# EAGLE design TERMOCOUPLER-1 (EAGLE 9.6.2)
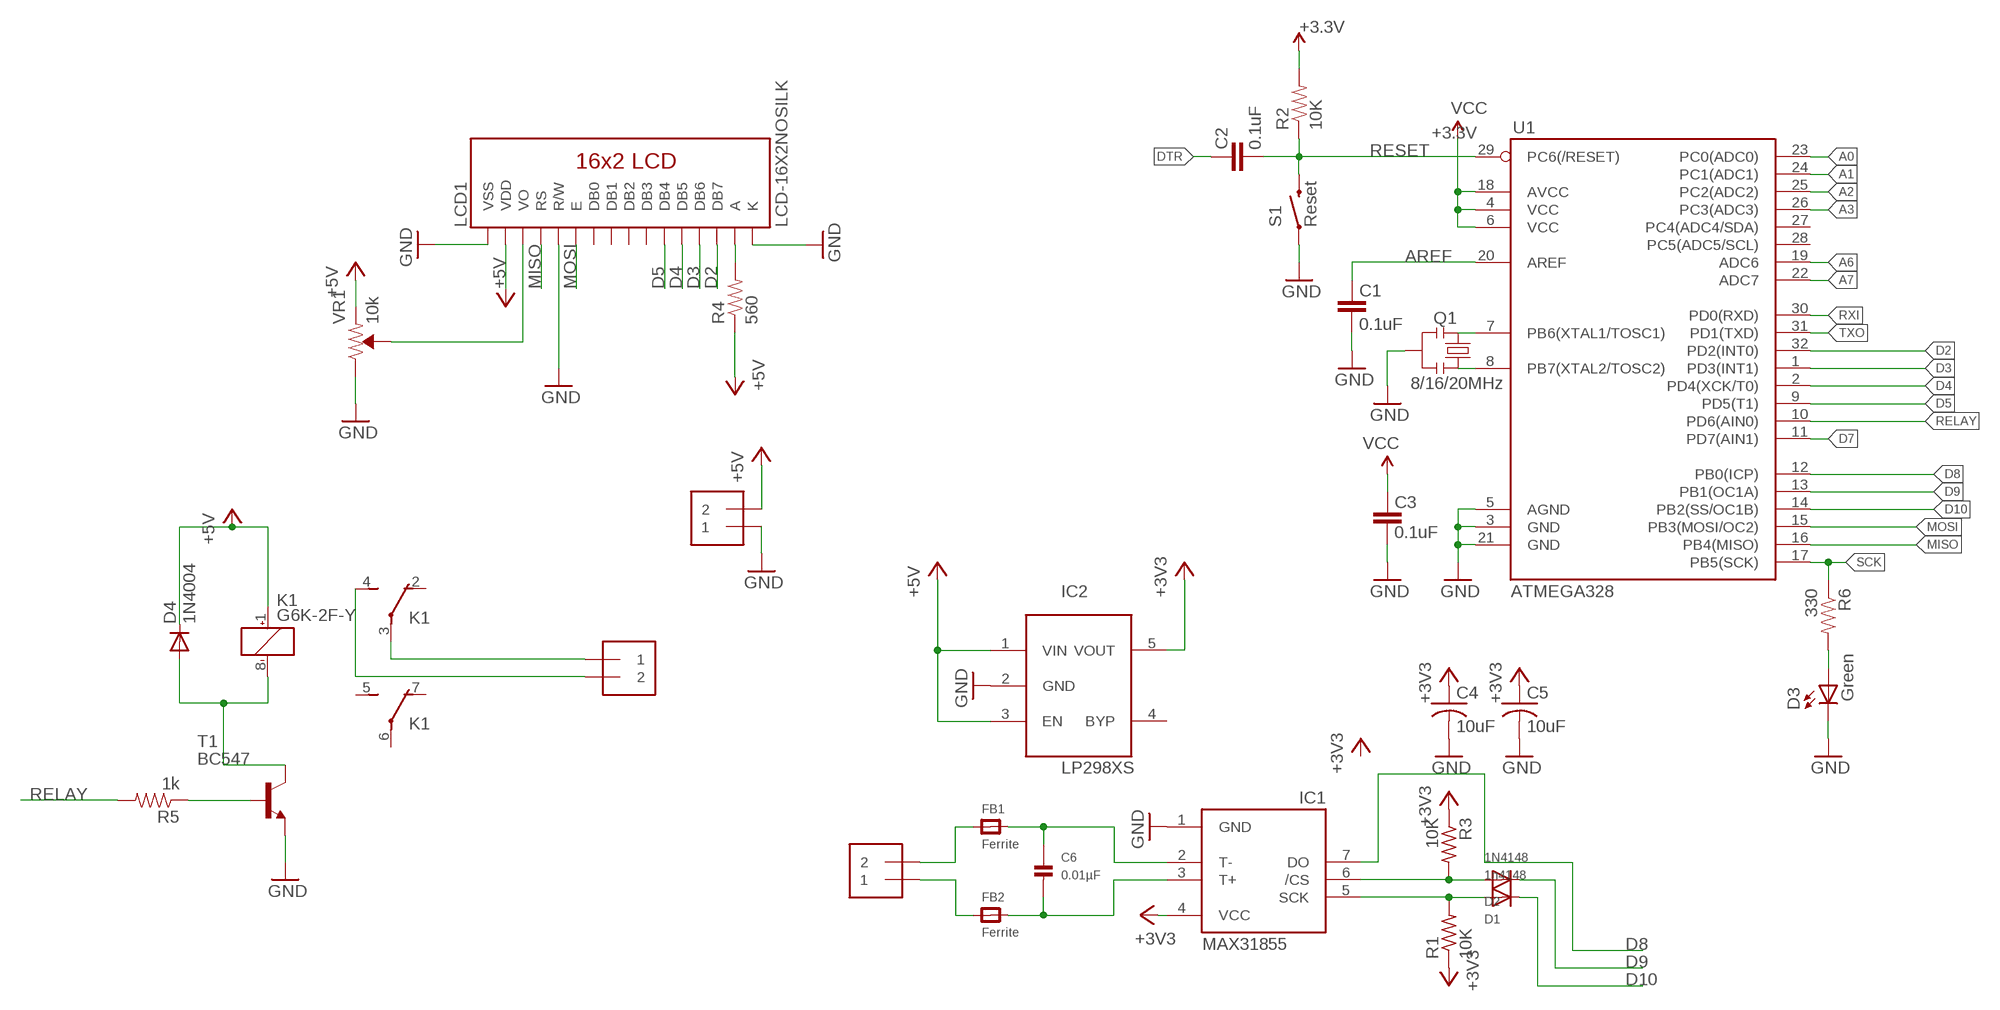
[diagram p0: schematic, sheet 1]

## Parts
C1  0.1uF  CAP0603-CAP  [0603-CAP]
C2  0.1uF  CAP0603-CAP  [0603-CAP]
C3  0.1uF  CAP0603-CAP  [0603-CAP]
C4  10uF  C-USC0805K  [C0805K]
C5  10uF  C-USC0805K  [C0805K]
C6  0.01µF  CAP_CERAMIC_0805  [_0805]
D1  1n4148  DIODESOD-323F  [SOD-323F]
D2  1N4148  DIODESOD-323F  [SOD-323F]
D3  Green  LED  [0603-LED-ALT1]
D4  1N4004  [DO41-10]
FB1  Ferrite  FERRITE_0805  [_0805]
FB2  Ferrite  FERRITE_0805  [_0805]
IC1  MAX31855  MAX6675  [SO08]
IC2  LP298XS  [SOT23-5L]
J1  1X2-3.5MM  [1X2-3.5MM]
J2  1X2-3.5MM  [1X2-3.5MM]
J3  1X2-3.5MM  [1X2-3.5MM]
K1  G6K-2F-Y  [G6K-2F-Y]
LCD1  LCD-16X2NOSILK  [LCD-16X2_NOSILK]
Q1  8/16/20MHz  RESONATOR1:1  [RESONATOR-SMD-1:1]
R1  10K  R-US_R0805  [R0805]
R2  10K  RESISTOR0603-RES  [0603-RES]
R3  10K  R-US_R0805  [R0805]
R4  560  RESISTOR0603-RES  [0603-RES]
R5  1k  RESISTOR0603-RES  [0603-RES]
R6  330  RESISTOR0603-RES  [0603-RES]
S1  Reset  SWITCH-MOMENTARY-2SMD-ALT01  [TACTILE-SWITCH-SMD-ALT01]
T1  BC547  [TO92]
U1  ATMEGA328  ATMEGA168  [TQFP32-08]
VR1  10k  TRIMPOT-SMD-3MM-CLOSED-1/8W-20%  [TRIMPOT-SMD-3MM-CLOSED]

## Nets
+3.3V: C3.2 R2.2 U1.4(VCC) U1.6(VCC) U1.18(AVCC) ; supply symbol labelled VCC
+3V3: C4.1 C5.1 IC1.4(VCC) IC2.5(VOUT) R1.1 R3.1
+5V: D4.C IC2.1(VIN) IC2.3(EN) J2.2 K1.1(1:+) LCD1.2(VDD) R4.1 VR1.1(CCW)
A0: U1.23(PC0(ADC0))
A1: U1.24(PC1(ADC1))
A2: U1.25(PC2(ADC2))
A3: U1.26(PC3(ADC3))
A6: U1.19(ADC6)
A7: U1.22(ADC7)
AREF: C1.2 U1.20(AREF)
CS: D2.A IC1.6(/CS) R3.2
D2: LCD1.14(DB7) U1.32(PD2(INT0))
D3: LCD1.13(DB6) U1.1(PD3(INT1))
D4: LCD1.12(DB5) U1.2(PD4(XCK/T0))
D5: LCD1.11(DB4) U1.9(PD5(T1))
D7: U1.11(PD7(AIN1))
D8: IC1.7(DO) U1.12(PB0(ICP))
D9: D2.C U1.13(PB1(OC1A))
D10: D1.C U1.14(PB2(SS/OC1B))
DTR: C2.2
GND [vcc]: C1.1 C3.1 C4.2 C5.2 D3.C IC1.1(GND) IC2.2(GND) J2.1 LCD1.1(VSS) LCD1.5(R/W) LCD1.16(K) Q1.2 S1.1 S1.2 T1.1(E) U1.3(GND) U1.5(AGND) U1.21(GND) VR1.3(CW)
MISO: LCD1.4(RS) U1.16(PB4(MISO))
MOSI: LCD1.6(E) U1.15(PB3(MOSI/OC2))
N$1: Q1.3 U1.8(PB7(XTAL2/TOSC2))
N$2: Q1.1 U1.7(PB6(XTAL1/TOSC1))
N$3: J3.1 K1.3(2:P)
N$4: D4.A K1.8(1:-) T1.3(C)
N$5: FB1.1 J1.2
N$6: C6.1 FB1.2 IC1.2(T-)
N$7: D3.A R6.2
N$8: FB2.1 J1.1
N$9: C6.2 FB2.2 IC1.3(T+)
N$10: J3.2 K1.4(2:S)
N$11: R5.1 T1.2(B)
N$13: LCD1.15(A) R4.2
N$18: LCD1.3(VO) VR1.2(WIPER)
RELAY: R5.2 U1.10(PD6(AIN0))
RESET: C2.1 R2.1 S1.3 S1.4 U1.29(PC6(/RESET))
RXI: U1.30(PD0(RXD))
SCK: R6.1 U1.17(PB5(SCK))
SCK1: D1.A IC1.5(SCK) R1.2
TXO: U1.31(PD1(TXD))
Unconnected: IC2.4(BYP) K1.2(2:O) K1.5(3:S) K1.6(3:P) K1.7(3:O) LCD1.7(DB0) LCD1.8(DB1) LCD1.9(DB2) LCD1.10(DB3) U1.27(PC4(ADC4/SDA)) U1.28(PC5(ADC5/SCL))

## Library data of the parts
C1-C3 = SparkFun:CAP: Capacitor Standard 0603 ceramic capacitor, and 0.1" leaded capacitor.
C4 C5 = adafruit:C-US: CAPACITOR, American symbol
C6 = microbuilder:CAP_CERAMIC: Ceramic Capacitors 0402 - 0402 Surface Mount Capacitors 16pF 50V 5% [Digikey: 445-4899-2-ND] 18pF 50V 5% [Digikey: 490-1281-2-ND] 22pF 50V 5% [Digikey: 490-1283-2-ND] 68pF 50V 5% [Digikey: 490-1289-2-ND] 0.1uF 10V 10% [Digikey: 490-1318-2-ND] 1.0uF 6.3V 10% [Digikey: 490-1320-2-ND] 0603 - 0603 Surface Mount Capacitors 16 pF 50V 5% [Digikey: 445-5051-2-ND] 22 pF 50V [Digikey: PCC220ACVTR-ND] 33 pF 50V 5% [Digikey: 490-1415-1-ND] 56pF 50V 5% [Digikey: 490-1421-1-ND] 220pF 50V 5% [Digikey: 445-1285-1-ND] 680 pF 50V 2200 pF 50V 5% C0G [Digikey: 445-1297-1-ND] 5600 pF 100V 5% X7R [Digikey: 478-3711-1-ND] 0.1 µF 25V 10% [Digikey: PCC2277TR-ND] 0.22 µF 16V 10% X7R [Digikey: 445-1318-1-ND] 1.0 µF 25V 10% [Digikey: 445-5146-2-ND] 0603 - RF Specific 3pF 250V +/-0.1pF RF [Digikey: 712-1347-1-ND] 18 pF 250V 5% [Digikey: 478-3505-1-ND or 712-1322-1-ND] 56 pF 250V 5% C0G RF [Digikey: 490-4867-1-ND] 68 pF 250V RF [Digikey: 490-4868-1-ND] 0805 - 0805 Surface Mount Capacitors 220 pF 250V 2% RF Ceramic Capacitor [Digikey: 712-1398-1-ND] 1000 pF 50V 2% NP0 Ceramic Capacitor [Digikey: 478-3760-1-ND] 0.1 µF 25V 10% Ceramic Capacitor [Digikey: PCC1828TR-ND] 1.0 µF 16V 10% Ceramic Capacitor[Digikey: 490-1691-2-ND] 10.0 µF 10V 10% Ceramic Capacitor[Digikey: 709-1228-1-ND] 10.0 uF 16V 10% Ceramic Capacitor [Digikey: 478-5165-2-ND] 47 uF 6.3V 20% Ceramic Capacitor [Digikey: 587-1779-1-ND or 399-5506-1-ND] 1206 - 1206 Surface Mount Capacitors 47uF 10V 20% Ceramic Capacitor [Digikey: 490-5528-1-ND or 399-5508-1-ND or 445-6010-1-ND] 100uF 6.3V -20%, +80% Y5V Ceramic Capacitor (Digikey: 490-4512-1-ND, Mouser: 81-GRM31CF50J107ZE1L)
D1 D2 = adafruit:DIODE: Diode SMADIODE - SMA Surface Mount Package 20V 1A Schottky Diode Digikey: 641-1014-6-ND DO-1N4148 - Through Hole Small Current Diode SOD-123 20V 1 A (.5mV Vf) Schottky Diode - Digikey: MBRX120TPMSCT-ND SOD-323 10V 570mA (.38mV Vf, 3ns) Schottky Diode - Digikey: ZLLS410CT-ND SOD-523 30V 30mA Schottky Diode (RB751S-40TE61) - Digikey: RB751S-40TE61CT-ND SOT23-R/W - SOT23 Package (R = Solder Paste/Reflow Ovens, W = Hand-Soldering) BAT54Film 40V 300mA - Digikey: 497-7162-1-ND
D3 = Testing:LED: LEDs Standard schematic elements and footprints for 5mm, 3mm, 1206, and 0603 sized LEDs. 5mm - Spark Fun Electronics SKU : COM-00529 (and others)
D4 = adafruit:1N4004: DIODE General purpose 1N400x type rectifier (With bigger pads) http://www.ladyada.net/library/pcb/eaglelibrary.html
FB1 FB2 = microbuilder:FERRITE: Ferrite Bead 0603 MMZ1608B121C - 120 Ohm @ 100MHz, 600mA, 0.15 Ohm DC Resistance - Digikey: 445-2164-1-ND BK1608HW121-T - 120 Ohm, 600mA Ferrite Chip - Digikey: 587-1876-2-ND 0805 HZ0805B272R-10 - 2.7K Ohm @ 100MHz, 200mA, 0.8 Ohm DC Resistance - Digikey: 240-2504-1-ND (see also Murata BLM21BD272SN1L) MMZ2012Y152B - 1.5K Ohm @ 100MHz, 500mA, 0.4 Ohm DC Resistance - Digikey: 445-1560-1-ND - Mainly for high frequency (80-400MHz) MMZ2012R102A - 1K Ohm @ 100MHz, 500mA, 0.3 Ohm DC Resistance - Digikey: 445-1555-2-ND - More general purpose (10-200MHz)
IC1 = adafruit:MAX6675
IC2 = adafruit:LP298X
J1-J3 = adafruit:1X2: 3.5mm Terminal block http://www.ladyada.net/library/pcb/eaglelibrary.html
K1 = relay:G6K: Low Signal Relay oeiwcsnts1.omron.com/.. D20G6K0100.pdf; MF: OMRON COMPONENTS USA; MPN: G6K-2F-Y DC3; OC_FARNELL: 1690316; OC_NEWARK: 89C6451
LCD1 = SparkFun-Displays:LCD-16X2: Standard text-only 16x2 parallel input LCD Basic 16 character by 2 line display. Typically utilizes the extremely common HD44780 parallel interface chipset SparkFun Products: Basic 16x2 Green <https://www.sparkfun.com/products/255> Basic 8x2 Green <https://www.sparkfun.com/products/11122>; SF_ID: LCD-00255
Q1 = Testing:RESONATOR: Resonator Small SMD resonator. This is the itty bitty 10/20MHz resonators with built in caps. CSTCE10M0G55 and CSTCE20M0V53. Footprint for SMD has been used in SFE production for years, and does work okay. 1:1 is an attempt to get larger fillets on the sides so it will be easier to inspect these solders in our AOI machine. The pads have been minimized to match the actual metal under the resonator. To see this relation, it includes an image import of the bottom side of the component. Imported to scale on layer 200.
R1 R3 = adafruit:R-US_: RESISTOR, American symbol
R2 R4-R6 = SparkFun:RESISTOR: Resistor Basic schematic elements and footprints for 0603, 1206, and PTH resistors.
S1 = Testing:SWITCH-MOMENTARY-2: Various NO switches- pushbuttons, reed, etc
T1 = transistor:BC547: NPN TRANSISTOR
U1 = SparkFun:ATMEGA168
VR1 = SparkFun-Resistors:TRIMPOT: Trimming Potentiometer (Trimpot) Three-terminal potentiometers, with an adjustable wiper and two adjustable resistors. A pot can be used to create a configurable voltage divider, or as a variable resistor. "Trimpots" are a subset of potentiometers, usually intended for "set-and-forget" applications. They're often more delicate than standard potentiometers - rated for fewer turns. Variants PTH-KNOB - PTH Trimpot w/ finger-adjustable knob Trimpot 10K with Knob <https://www.sparkfun.com/products/9806> (COM-09806) Datasheet <http://www.sparkfun.com/datasheets/Components/General/TSR-3386.pdf> SMD-3MM-CLOSED-FRAME - SMD 3mm Square Closed-Frame Trimpot Used on e.g. EasyDriver - Stepper Motor Driver <https://www.sparkfun.com/products/12779> Datasheet <http://www.bitechnologies.com/pdfs/22.pdf> (22AR10KTR) SMD-5MM - SMD 5mm Square Closed-Frame Trimpot Used on e.g. IOIO-OTG - V2.2 <https://www.sparkfun.com/products/13613> Datasheet <http://www.vishay.com/docs/51008/ts53.pdf> (TS53YL502MR10) SMD-3MM-1/10W-25% - 3mm Square Open-Frame Trimpot Used on e.g. SparkFun Shapeoko <https://www.sparkfun.com/products/13899> Datasheet <http://www.bourns.com/docs/Product-Datasheets/TC33.pdf> (TC33X-2-103E); PROD_ID: RES-09285

## Net classes
1 vcc: width 0.254 mm

## Board
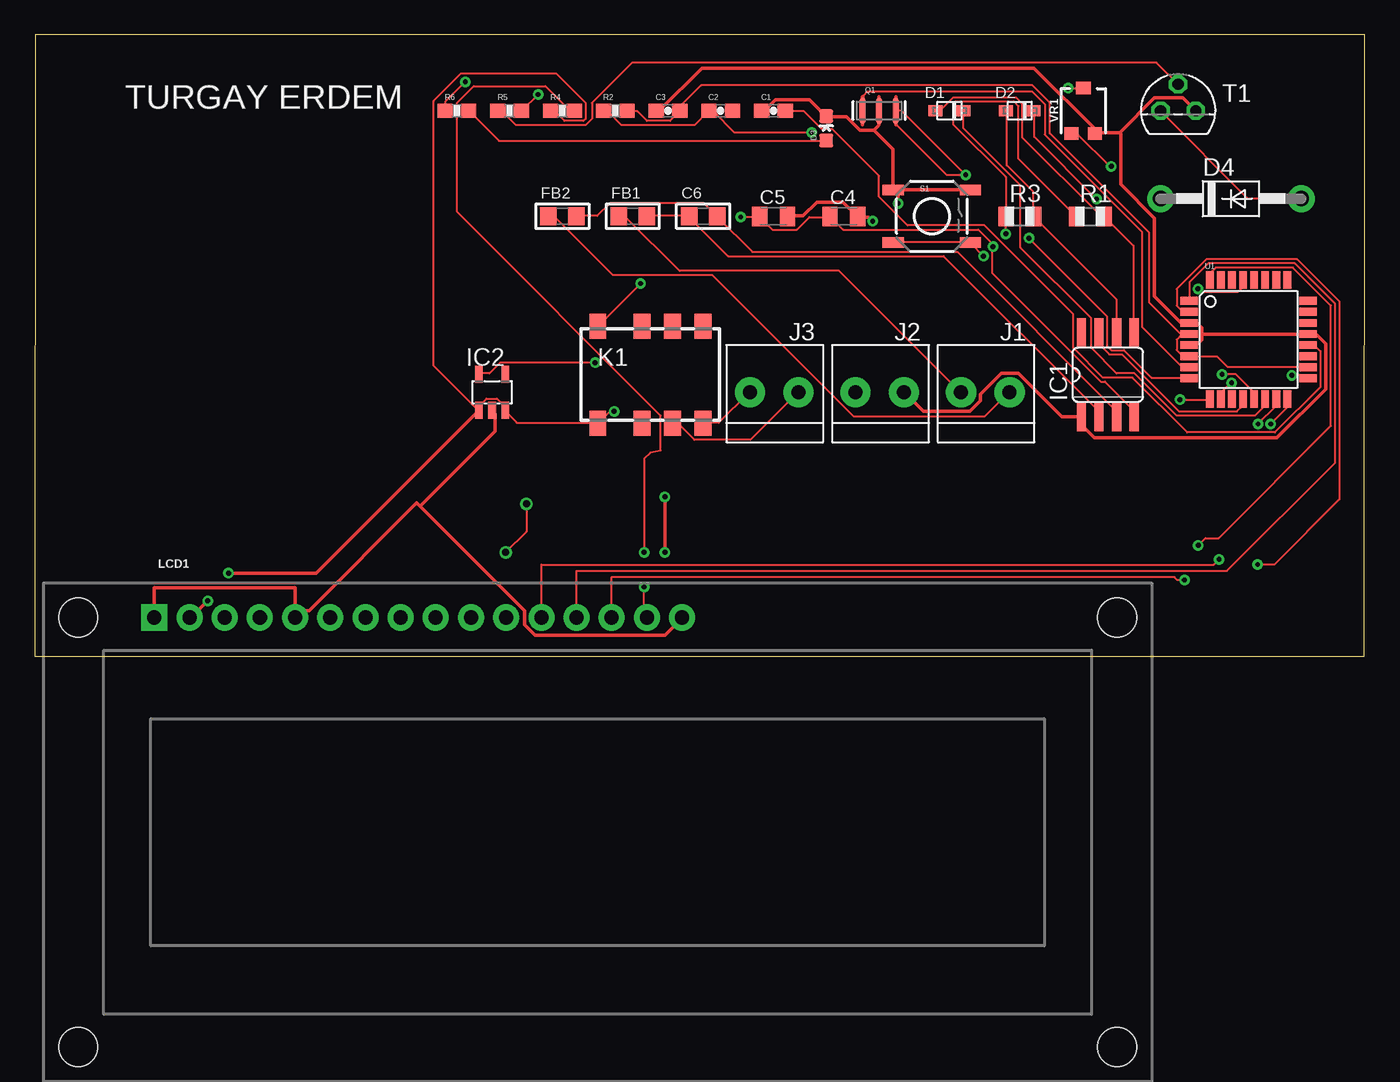
[diagram p1: board, top side]
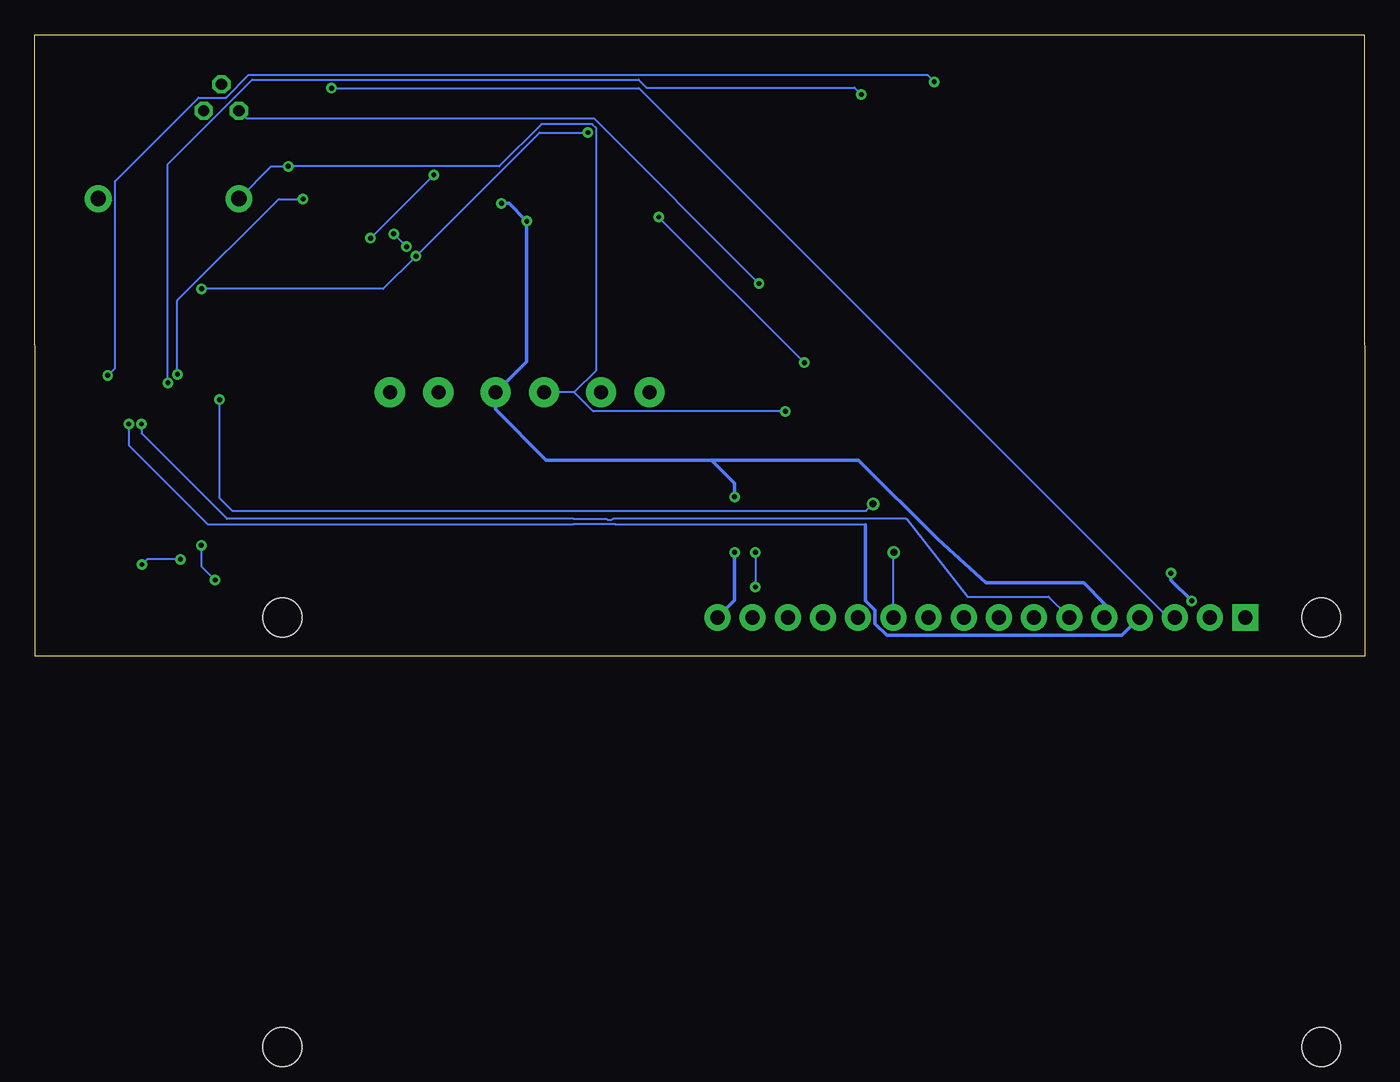
[diagram p2: board, bottom side, seen from below]

Size 96.03 x 44.86 mm. Coordinates in mm from the lower left corner, seen from the top.
Outline: 0,0 96,0 96.03,44.86 0.03,44.86 0,0
Copper layers (1*16): Top 0.035mm / dielectric 1.5mm / Bottom 0.035mm
Design rules "default": minimum track width 6mil, minimum drill 0.35mm, track to track 6mil, track to pad 6mil, pad to pad 6mil, via to via 6mil, smd to smd 6mil, copper to edge 40mil, drill to drill 6mil, minimum pad ring 10mil, minimum via ring 8mil, stop-mask expansion 4mil, vias tented up to drill 0mil, thermal gap 10mil

### Footprints (pad centres in the part's own frame; a part is rotated, then mirrored left to right if it is on the bottom)
0603-CAP = smd 1.1 x 1: 1 -0.85,0; 2 0.85,0
C0805K = smd 1.1 x 1.4: 1 -1,0; 2 1,0
_0805 = smd 1.2 x 1.3: 1 -1.016,0; 2 1.016,0
SOD-323F = smd 1 x 0.8: A -1,0; C 1,0
0603-LED-ALT1 = smd 1 x 1: A 0,-0.877; C 0,0.877
DO41-10 = drill 1.118 pad 1.93: A 5.08,0; C -5.08,0
SO08 = smd 0.66 x 2.032: 1 -1.905,-3.073; 2 -0.635,-3.073; 3 0.635,-3.073; 4 1.905,-3.073; 5 1.905,3.073; 6 0.635,3.073; 7 -0.635,3.073; 8 -1.905,3.073
SOT23-5L = smd 0.55 x 1.2: 1 -0.95,-1.3; 2 0,-1.3; 3 0.95,-1.3; 4 0.95,1.3; 5 -0.95,1.3
1X2-3.5MM = drill 1 pad 2.184: 1 1.8,0; 2 -1.7,0
G6K-2F-Y = smd 1.2 x 1.8: 1 -3.8,-3.5; 2 -0.6,-3.5; 3 1.6,-3.5; 4 3.8,-3.5; 5 3.8,3.5; 6 1.6,3.5; 7 -0.6,3.5; 8 -3.8,3.5
LCD-16X2_NOSILK = drill 1.016 pad 1.88 square: 1 -32,15.5 | drill 1.016 pad 1.88: 2 -29.46,15.5; 3 -26.92,15.5; 4 -24.38,15.5; 5 -21.84,15.5; 6 -19.3,15.5; 7 -16.76,15.5; 8 -14.22,15.5; 9 -11.68,15.5; 10 -9.14,15.5; 11 -6.6,15.5; 12 -4.06,15.5; 13 -1.52,15.5; 14 1.02,15.5; 15 3.56,15.5; 16 6.1,15.5 | hole 2.8: -37.5,15.5; -37.5,-15.5; 37.5,15.5; 37.5,-15.5
RESONATOR-SMD-1:1 = smd 0.45 x 1.905: 1 -1.2,0; 2 0,0; 3 1.2,0
R0805 = smd 1.1 x 1.4: 1 -1,0; 2 1,0
0603-RES = smd 1.1 x 1: 1 -0.85,0; 2 0.85,0
TACTILE-SWITCH-SMD-ALT01 = smd 1.524 x 0.762: 1 -2.794,1.905; 2 2.794,1.905; 3 -2.794,-1.905; 4 2.794,-1.905
TO92 = drill 0.813 octagon: 1 1.27,0; 2 0,1.905; 3 -1.27,0
TQFP32-08 = smd 1.27 x 0.559: 1 -4.293,2.8; 2 -4.293,2; 3 -4.293,1.2; 4 -4.293,0.4; 5 -4.293,-0.4; 6 -4.293,-1.2; 7 -4.293,-2; 8 -4.293,-2.8; 17 4.293,-2.8; 18 4.293,-2; 19 4.293,-1.2; 20 4.293,-0.4; 21 4.293,0.4; 22 4.293,1.2; 23 4.293,2; 24 4.293,2.8 | smd 0.559 x 1.27: 9 -2.8,-4.293; 10 -2,-4.293; 11 -1.2,-4.293; 12 -0.4,-4.293; 13 0.4,-4.293; 14 1.2,-4.293; 15 2,-4.293; 16 2.8,-4.293; 25 2.8,4.293; 26 2,4.293; 27 1.2,4.293; 28 0.4,4.293; 29 -0.4,4.293; 30 -1.2,4.293; 31 -2,4.293; 32 -2.8,4.293
TRIMPOT-SMD-3MM-CLOSED = smd 1 x 0.9: 1 -0.85,-1.65; 3 0.85,-1.65 | smd 1.1 x 0.9: 2 0,1.65

### Placement (x,y rotation side)
C1  53.34,39.37 0 top
C2  49.53,39.37 0 top
C3  45.72,39.37 0 top
C4  58.42,31.75 0 top
C5  53.34,31.75 0 top
C6  48.26,31.75 0 top
D1  66.04,39.37 0 top
D2  71.12,39.37 0 top
D3  57.15,38.1 0 top
D4  86.36,33.02 0 top
FB1  43.18,31.75 0 top
FB2  38.1,31.75 0 top
IC1  77.47,20.32 0 top
IC2  33.02,19.05 0 top
J1  68.58,19.05 0 top
J2  60.96,19.05 0 top
J3  53.34,19.05 0 top
K1  44.45,20.32 0 top
LCD1  40.64,-12.7 0 top
Q1  60.96,39.37 0 top
R1  76.2,31.75 0 top
R2  41.91,39.37 0 top
R3  71.12,31.75 0 top
R4  38.1,39.37 0 top
R5  34.29,39.37 0 top
R6  30.48,39.37 0 top
S1  64.77,31.75 0 top
T1  82.55,39.37 0 top
U1  87.63,22.86 0 top
VR1  75.7,39.37 0 top

### Tracks (layer width: path | path; a pad name or v marks a point on that pad's centre or on a via)
+3.3V
  Top 0.152: R2.2 42.82,39.32 43.51,39.32 44.2,38.63 45.87,38.63 46.56,39.32 C3.2 46.57,39.65 48.12,41.19 72.04,41.19 73.28,39.95 73.28,37.74 80.47,30.56 80.47,25.53 82.75,23.24 U1.4 83.29,23.24 82.83,23.24 82.45,22.86 82.45,22.1 82.83,21.72 83.29,21.72 U1.6 83.36,21.64 85.34,21.64 86.11,20.88 91.9,20.88 U1.18
+3V3  (via drill 0.35)
  Top 0.152: R1.1 75.13,31.77 71.02,35.89 71.02,39.7 70.71,40.01 66.45,40.01 66.29,39.85 66.29,38.41 70.1,34.59 70.1,31.77 R3.1 70.1,31.7 v70.1,30.48 | v40.46,21.18 33.6,21.18 32.84,20.42 32.08,20.42 IC2.5 | v50.98,31.7 52.27,31.7 C5.1 52.35,31.7 53.26,30.79 55.02,30.79 55.93,31.7 57.38,31.7 C4.1 57.45,31.7 58.37,30.79 68.12,30.79 69.11,29.79 69.11,29.57 | 69.11,29.57 69.11,27.66 76.96,19.81 77.27,19.81 79.32,17.75 79.32,17.3 IC1.4 | 69.11,29.57 v69.19,29.57
  Bottom 0.152: v50.98,31.7 v40.46,21.18 | v69.19,29.57 v70.1,30.48
+5V  (via drill 0.35)
  Top 0.152: v77.72,35.36 77.61,35.36 75.29,37.68 VR1.1 | R4.1 37.26,39.32 37.57,39.32 38.25,38.63 39.62,38.63 39.78,38.79 39.78,39.93 37.64,42.06 30.79,42.06 28.8,40.08 28.8,20.95 32,17.75 IC2.1 31.93,17.91 32.61,18.59 33.38,18.59 33.91,18.06 33.91,17.75 IC2.3 33.98,17.68 34.78,16.88 34.82,16.84 40.62,16.84 K1.1 40.69,16.84 41.53,17.68 v41.83,17.68
  Top 0.254: IC2.1 20.32,6 v14,6 | LCD1.2 11.3,2.8 v12.5,4
  Bottom 0.152: D4.C 78.94,35.36 v77.72,35.36 62.48,35.36 59.44,38.41 55.78,38.41 55.47,38.1 55.47,20.65 57.07,19.05 | 57.07,19.05 J2.2 | 57.07,19.05 55.7,17.68 v41.83,17.68
  Bottom 0.254: v14,6 14,5.5 v12.5,4
AREF
  Top 0.152: C1.2 54.25,39.32 55.55,39.32 56.84,38.02 57.61,38.02 60.96,34.67 60.96,33.15 63.02,31.09 68.58,31.09 74.98,24.69 74.98,22.25 77.11,20.12 79.25,20.12 83.21,16.15 89.53,16.15 92.81,19.43 92.81,22.02 92.43,22.4 91.97,22.4 U1.20
CS
  Top 0.152: D2.A 70.18,39.32 70.18,35.43 72.08,33.53 72.08,31.77 R3.2 72.16,31.7 78.11,25.76 IC1.6
D2  (via drill 0.35 pad 0.55)
  Top 0.152: U1.32 84.89,27.2 84.89,27.66 85.27,28.04 90.83,28.04 93.57,25.3 93.57,16.63 85.47,8.53 84.53,8.53 v84,8 | LCD1.14 41.66,5.72 82.28,5.72 82.5,5.5 v83,5.5
  Bottom 0.152: v84,8 84,6.5 v83,5.5
D3
  Top 0.152: U1.1 83.36,25.68 83.36,26.98 84.73,28.35 90.98,28.35 93.88,25.45 93.88,13.97 86.07,6.17 39.12,6.17 LCD1.13
D4  (via drill 0.35 pad 0.55)
  Top 0.152: U1.2 83.29,24.92 82.83,24.92 82.45,25.3 82.45,26.52 84.58,28.65 91.14,28.65 94.18,25.6 94.18,11.32 89.48,6.62 v88.28,6.62 | LCD1.12 36.58,6.61 85.11,6.61 v85.5,7
  Bottom 0.152: v85.5,7 87.9,7 v88.28,6.62
D5  (via drill 0.35, 0.5 pad 0.55)
  Top 0.152: v82.68,18.52 84.81,18.52 U1.9 | v35.5,11 35.5,9 v34,7.5
  Bottom 0.152: v82.68,18.52 82.68,11.41 81.76,10.5 36,10.5 v35.5,11 | LCD1.11 34.04,6.5 34.04,7.46 v34,7.5
D8
  Top 0.152: U1.12 87.17,18.52 87.17,18.06 86.79,17.68 82.6,17.68 78.49,21.79 77.57,21.79 76.89,22.48 76.89,23.39 IC1.7
D9  (via drill 0.35)
  Top 0.152: v76.66,32.99 72.16,37.49 72.16,39.32 D2.C | v85.72,20.34 86.72,20.34 88.01,19.05 88.01,18.59 U1.13
  Bottom 0.152: v76.66,32.99 78.41,32.99 85.72,25.68 v85.72,20.34
D10
  Top 0.152: D1.C 67.06,39.32 67.06,38.1 71.17,33.98 71.17,29.49 76.28,24.38 76.28,22.25 78.11,20.42 79.4,20.42 82.45,17.37 88.09,17.37 88.77,18.06 88.77,18.52 U1.14
GND  (via drill 0.35, 0.35 pad 0.55)
  Top 0.254: 84.28,23.24 84.28,23.7 83.97,24 83.36,24 U1.3 83.21,24.08 82.75,24.08 80.85,25.98 80.85,31.62 78.41,34.06 78.41,37.72 78.33,37.8 | 84.28,23.24 84.28,22.86 83.9,22.48 83.36,22.48 U1.5 | 84.28,23.24 91.9,23.24 U1.21 91.97,23.16 92.58,23.16 93.19,22.55 93.19,19.28 89.69,15.77 76.5,15.77 75.59,16.69 75.59,17.14 IC1.1 75.51,17.3 74.14,17.3 71.02,20.42 69.8,20.42 68.28,18.9 68.28,18.44 67.51,17.68 64.16,17.68 62.79,19.05 J2.1 | 78.33,37.8 76.61,37.8 VR1.3 76.71,37.9 72.15,42.45 48.17,42.45 45.11,39.4 44.88,39.4 C3.1 | 78.33,37.8 80.85,40.31 82.91,40.31 83.82,39.4 T1.1 | IC2.2 33.25,17.52 33.25,16.25 27.82,10.82 | LCD1.1 8.64,4.94 18.8,4.94 LCD1.5 19.3,3.3 19.8,3.3 27.57,11.07 27.82,10.82 | 60.58,37.95 59.59,37.95 58.6,38.94 57.15,38.94 D3.C 57.07,39.01 55.93,40.16 53.49,40.16 52.73,39.4 52.5,39.4 C1.1 | 60.58,37.95 60.88,38.25 60.96,38.35 Q1.2 | 60.58,37.95 61.95,36.58 61.95,33.68 S1.1 | S1.2 67.51,33.68 62.03,33.68 S1.1 | C5.2 54.41,31.77 55.47,31.77 56.46,32.77 58.37,32.77 59.36,31.77 C4.2 59.51,31.7 60.2,31.7 v60.5,31.39 | v62.33,32.69 62.33,33.6 S1.1 | 27.82,10.82 35.36,3.28 35.36,2.29 36.12,1.52 45.49,1.52 46.71,2.74 LCD1.16 | v45.5,11.5 v45.5,7.5
  Bottom 0.254: v62.33,32.69 61.8,32.69 v60.5,31.39 60.5,21.26 62.71,19.05 J2.1 62.76,17.82 59.1,14.16 47.16,14.16 | 47.16,14.16 36.55,14.16 30.83,8.44 27.37,5.3 20.3,5.3 18.8,3.8 LCD1.5 | 47.16,14.16 45.5,12.5 v45.5,11.5 | LCD1.16 45.5,4.04 v45.5,7.5
MISO  (via drill 0.35)
  Top 0.152: v89.23,16.76 90.37,17.91 90.37,18.52 U1.16
  Bottom 0.152: v89.23,16.76 89.23,15.24 83.49,9.5 57.2,9.5 57.15,9.53 54.1,9.53 54.05,9.5 36.05,9.5
  Bottom 0.254: LCD1.4 17.56,1.5 34.5,1.5 35.36,2.36 35.36,3.31 36.05,3.99 36.05,9.5
MOSI  (via drill 0.35)
  Top 0.152: v88.32,16.76 89.61,18.06 89.61,18.52 U1.15
  Bottom 0.152: v88.32,16.76 88.32,16.09 82.14,9.91 57.12,9.91 57.07,9.91 54.71,9.91 54.63,9.83 54.41,9.83 54.33,9.91 54.26,9.91 33.11,9.91 28.69,4.3 22.84,4.3 LCD1.6
N$1  (via drill 0.35)
  Top 0.152: v71.78,30.18 77.42,24.54 77.42,22.4 77.72,22.1 78.64,22.1 80.62,20.12 83.29,20.12 U1.8 | 62.16,38.35 62.26,38.33 65.84,34.75 v67.21,34.75 62.59,39.37 Q1.3 | 62.16,38.35 62.18,38.41 62.16,38.35
  Bottom 0.152: v67.21,34.75 v71.78,30.18
N$2
  Top 0.152: U1.7 83.29,20.88 82.83,20.88 79.93,23.77 79.93,30.63 72.92,37.64 72.92,39.85 72.01,40.77 60.12,40.77 59.82,40.46 Q1.1
N$3
  Top 0.152: K1.3 46.1,16.76 46.48,16.76 47.62,15.62 51.66,15.62 55.09,19.05 J3.1
N$4  (via drill 0.35)
  Top 0.152: v43.74,26.9 40.69,23.85 K1.8 | D4.A 91.44,33.07 87.55,33.07 81.31,39.32 T1.3
  Bottom 0.152: v43.74,26.9 55.66,38.82 80.73,38.82 T1.3
N$5
  Top 0.152: FB1.1 42.22,31.7 42.67,31.7 46.56,27.81 58.06,27.81 66.83,19.05 J1.2
N$6
  Top 0.152: FB1.2 44.2,31.77 47.24,31.77 C6.1 47.24,31.7 50.06,28.88 65.61,28.88 76.81,17.68 76.81,17.3 IC1.2
N$7
  Top 0.152: D3.A 57.15,37.19 33.53,37.19 31.39,39.32 R6.2
N$8
  Top 0.152: FB2.1 37.11,31.7 37.57,31.7 41.76,27.51 48.92,27.51 59.13,17.3 68.58,17.3 70.33,19.05 J1.1
N$9
  Top 0.152: FB2.2 39.17,31.77 40.62,31.77 41.53,32.69 48.31,32.69 49.23,31.77 C6.2 49.3,31.7 51.82,29.18 66.6,29.18 78.11,17.68 IC1.3
N$10
  Top 0.152: K1.4 48.31,16.84 49.38,16.84 51.59,19.05 J3.2
N$11
  Top 0.152: T1.2 80.99,42.83 43.14,42.83 40.23,39.93 40.23,38.79 39.78,38.33 34.75,38.33 33.76,39.32 33.45,39.32 R5.1
N$13  (via drill 0.35 pad 0.55)
  Top 0.152: R4.2 38.94,39.4 38.63,39.4 36.88,41.15 31.7,41.15 30.48,39.93 30.48,32.08 45.19,17.37 45.19,14.85 44.46,14.7 44,14.24 v44,7.5 | LCD1.15 44,3 v44,5
  Bottom 0.152: v44,7.5 v44,5
N$18  (via drill 0.35)
  Top 0.152: v74.6,41 75.7,41 VR1.2
  Bottom 0.152: v74.6,41 52.42,41 14.22,2.8 LCD1.3
RELAY  (via drill 0.35)
  Top 0.152: v36.35,40.54 35.2,39.4 R5.2 | v86.41,19.74 86.11,19.43 86.03,19.43 85.65,19.05 85.65,18.59 U1.10
  Bottom 0.152: v36.35,40.54 36.85,41.04 51.86,41.04 52.43,41.6 80.31,41.6 86.41,35.51 v86.41,19.74
RESET  (via drill 0.35)
  Top 0.152: R2.1 41.07,39.32 41.38,39.32 42.37,38.33 47.62,38.33 48.62,39.32 C2.1 48.69,39.32 49,39.32 50.52,37.8 v56.08,37.8 | v83.97,26.52 84.2,26.29 86.87,26.29 87.17,26.59 87.17,27.13 U1.29 | v68.5,28.88 67.59,29.79 S1.4 67.51,29.87 62.03,29.87 S1.3
  Bottom 0.152: v83.97,26.52 70.87,26.52 v68.5,28.88 59.59,37.8 v56.08,37.8
SCK  (via drill 0.35)
  Top 0.152: v31.09,41.45 29.64,40.01 29.64,39.4 R6.1 | v90.75,20.27 91.75,20.27 91.9,20.12 U1.17
  Bottom 0.152: v31.09,41.45 31.59,41.95 80.58,41.95 82.22,40.31 84.2,40.31 90.22,34.29 90.22,20.8 v90.75,20.27
SCK1
  Top 0.152: D1.A 65.08,39.4 65.38,39.4 66.29,40.31 70.87,40.31 71.32,39.85 71.32,37.41 76.96,31.77 77.19,31.77 R1.2 77.27,31.7 79.32,29.64 79.32,23.39 IC1.5

### Text on the board
tPlace: TURGAY ERDEM